# Altium schematic sheet DP.SchDoc
size A3; SPICEModelCacheHOTVAOKI: <root> / <DocumentId>HOTVAOKI</DocumentId> / </root>; SheetNumber: 4; SheetTotal: 9
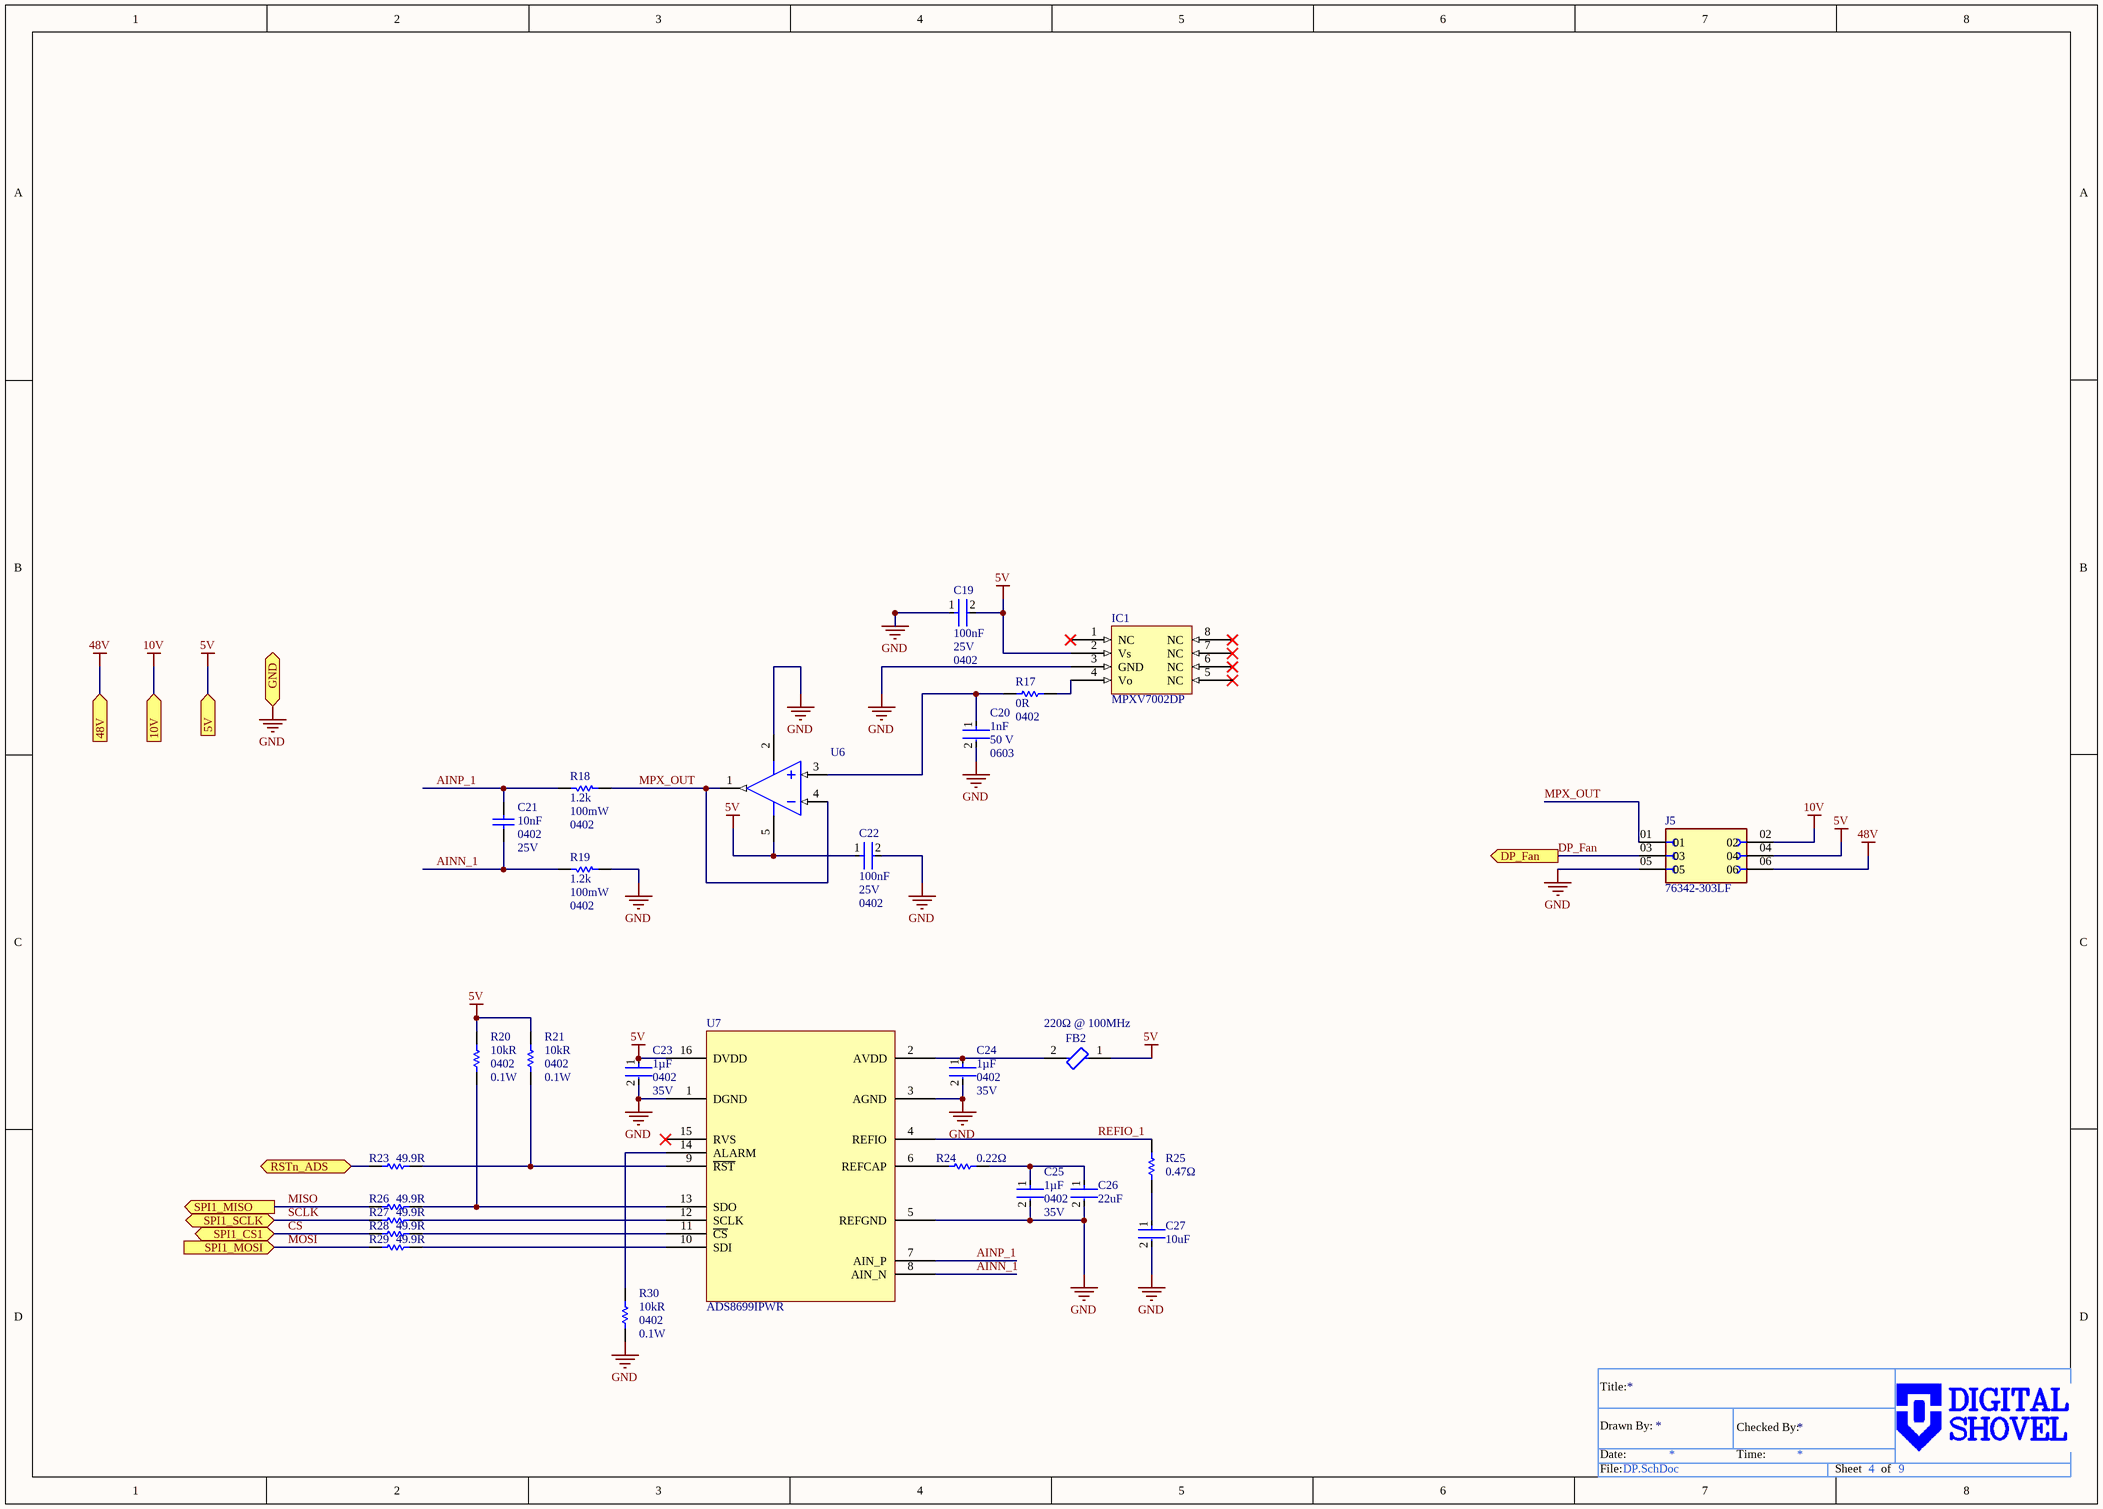
[diagram p0: DP.SchDoc]

## Parts
C19  value 100nF  Voltage Rating: 25V  Case/Package: 0402  [FP-CL830-IPC_A]  (hidden comment: CL05B104KA5NNNC)
C20  value 1nF  Voltage Rating: 50 V  Package: 0603  [FP-C0603C-CF-MFG]  (hidden comment: C0603C102K5RACTU)
C21  value 10nF  Package: 0402  Parameter 1: 25V  [CAPC1005X55X25ML05T10]  (hidden comment: GRM155R71E103KA01D)
C22  value 100nF  Voltage Rating: 25V  Case/Package: 0402  [FP-CL830-IPC_A]  (hidden comment: CL05B104KA5NNNC)
C23  value 1µF  Case/Package: 0402  Voltage Rating: 35V  [FP-C1005-050-0_05-IPC_A]  (hidden comment: C1005JB1V105K050BC)
C24  value 1µF  Case/Package: 0402  Voltage Rating: 35V  [FP-C1005-050-0_05-IPC_A]  (hidden comment: C1005JB1V105K050BC)
C25  value 1µF  Case/Package: 0402  Voltage Rating: 35V  [FP-C1005-050-0_05-IPC_A]  (hidden comment: C1005JB1V105K050BC)
C26  value 22uF  [FP-GRM21B-0_2-e0_2_0_7-IPC_A]  (hidden comment: GRM21BR61C226ME44L)
C27  value 10uF  [FP-CL21-IPC_B]  (hidden comment: CL21A106KAFN3NE)
FB2  value 220Ω @ 100MHz  [FP-BLM18-0_15-t0_8-IPC_C]  (hidden comment: BLM18KG221SN1D)
IC1  MPXV7002DP  [MPXV7002DP-Footprint-1]
J5  76342-303LF  [AMPHENOL_76342-303LF]
R17  value 0R  Package: 0402  [FP-RK73Z1E-IPC_B]  (hidden comment: RK73Z1ETTP)
R18  value 1.2k  Power: 100mW  Case/Package: 0402  [RESC1005X40X25LL10T10]  (hidden comment: RK73H1ETTP1201F)
R19  value 1.2k  Power: 100mW  Case/Package: 0402  [RESC1005X40X25LL10T10]  (hidden comment: RK73H1ETTP1201F)
R20  value 10kR  Package: 0402  Power Rating: 0.1W  [RESC1005X40X25LL10T10]  (hidden comment: RK73H1ETTP1002F)
R21  value 10kR  Package: 0402  Power Rating: 0.1W  [RESC1005X40X25LL10T10]  (hidden comment: RK73H1ETTP1002F)
R23  value 49.9R  [RESC1005X40X25LL10T10]  (hidden comment: RK73H1ETTP49R9F)
R24  value 0.22Ω  [RESC1608X55X30NL15T15]  (hidden comment: ERJ-3RQFR22V)
R25  value 0.47Ω  [RESC1608X55X30ML15T15]  (hidden comment: ERJ-3RQFR47V)
R26  value 49.9R  [RESC1005X40X25LL10T10]  (hidden comment: RK73H1ETTP49R9F)
R27  value 49.9R  [RESC1005X40X25LL10T10]  (hidden comment: RK73H1ETTP49R9F)
R28  value 49.9R  [RESC1005X40X25LL10T10]  (hidden comment: RK73H1ETTP49R9F)
R29  value 49.9R  [RESC1005X40X25LL10T10]  (hidden comment: RK73H1ETTP49R9F)
R30  value 10kR  Package: 0402  Power Rating: 0.1W  [RESC1005X40X25LL10T10]  (hidden comment: RK73H1ETTP1002F)
U6  THS4281DBVR  [DBV0005A_L]  (value not drawn)
U7  ADS8699IPWR  [TSOP65P640X120-16N]

## Ports
5V (in), 10V (in), 48V (in), DP_Fan (out), GND (bidir), RSTn_ADS (bidir), SPI1_CS1 (bidir), SPI1_MISO (out), SPI1_MOSI (in), SPI1_SCLK (bidir)

## Nets
5V: C19.2 C22.1 C23.1 FB2.1 IC1.2(Vs) J5.04 R20.2 R21.2 U6.5(VS+) U7.16(DVDD) ; port 5V
10V: J5.02 ; port 10V
48V: J5.06 ; port 48V
GND: C19.1 C20.2 C22.2 C23.2 C24.2 C25.2 C26.2 C27.2 IC1.3(GND) J5.05 R19.1 R30.1 U6.2(VS-) U7.1(DGND) U7.3(AGND) U7.5(REFGND) ; port GND
~{C}S: R28.1 ; port SPI1_CS1
AINN_1: C21.1 R19.2 U7.8(AIN_N)
AINP_1: C21.2 R18.2 U7.7(AIN_P)
DP_Fan: J5.03 ; port DP_Fan
MISO: R26.1 ; port SPI1_MISO
MOSI: R29.1 ; port SPI1_MOSI
MPX_OUT: J5.01 R18.1 U6.1(VOUT) U6.4(IN-)
REFIO_1: R25.2 U7.4(REFIO)
RSTn_ADS: R23.1 ; port RSTn_ADS
SCLK: R27.1 ; port SPI1_SCLK
NetC20_1: C20.1 R17.2 U6.3(IN+)
NetC24_1: C24.1 FB2.2 U7.2(AVDD)
NetC25_1: C25.1 C26.1 R24.2
NetC27_1: C27.1 R25.1
NetIC1_4: IC1.4(Vo) R17.1
NetR20_1: R20.1 R26.2 U7.13(SDO)
NetR21_1: R21.1 R23.2 U7.9(~{RST})
NetR24_1: R24.1 U7.6(REFCAP)
NetR27_2: R27.2 U7.12(SCLK)
NetR28_2: R28.2 U7.11(~{CS})
NetR29_2: R29.2 U7.10(SDI)
NetR30_2: R30.2 U7.14(ALARM)

Not connected (* = marked no-connect by the designer): IC1 1(NC)* 5(NC)* 6(NC)* 7(NC)* 8(NC)*; U7 15(RVS)*

## Notes on the sheet
- Title:
- Date:
- Drawn By:
- Time:
- Checked By:
- File:
- Sheet
- of

## Library data of the parts
C19 C22 = CMP-001-00333-1: Ceramic Capacitor, Multilayer, Ceramic, 25V, 10% +Tol, 10% -Tol, X7R, 15% TC, 0.1uF, Surface Mount, 0402; Max Operating Temperature: 125°C; RoHS Compliant: Yes; Capacitor Type: Ceramic; Min Operating Temperature: -55°C; Pins: 2; Mounting Technology: Surface Mount
C20 = CMP-2006-03022-3: CAP CER 1000PF 50V X7R 0603; Manufacturer: KEMET; Automotive Grade: Grade 1; Tolerance: 0.1; Capacitance: 1,000 pF; Temperature Coefficient: 30ppm/°C; Material: Ceramic; Temperature Characteristic: X7R; ComponentLink2URL: https://api.kemet.com/component-edge/download/datasheet/C0603C100J5GACAUTO.pdf; Temperature Range Low: -55°C; Device Class L2: Capacitors; Device Class L3: Ceramic Capacitors; Device Class L1: Passive Components; Temperature Range High: +125°C; Manufacturer Part Number: C0603C102K5RACTU; Digikey Description: CAP CER 1000PF 50V X7R 0603; Temperature: -55°C to +125°C; Mouser Description: Capacitor; Ceramic; Cap; 1000pF; Tol 10%; SMT; Vol-Rtg 50V; X7R; Tape and Reel; Automotive: Yes; RoHS: TRUE; Octopart: https://octopart.com/c0603c102k5ractu-kemet-144878; Height: 0.87mm; Lead Free: Yes; Category: Cap; ComponentLink2Description: Datasheet
C21 = CMP-x00072-1: Ceramic Capacitor, Multilayer, Ceramic, 25V, 10% +Tol, 10% -Tol, X7R, 15% TC, 0.01uF, Surface Mount, 0402; Manufacturer: Murata; Template: MR_0402; Vendor: TTI; Reel Width: 8mm; Mounting: SMT; MOQ: 10000; Category: Capacitor; Price: 0.00352
C23-C25 = CMP-001-00329-1: Ceramic Capacitor, Multilayer, Ceramic, 35V, 10% +Tol, 10% -Tol, JB, 10% TC, 1uF, Surface Mount, 0402; Capacitor Type: Ceramic; Min Operating Temperature: -25°C; RoHS Compliant: Yes; Max Operating Temperature: 85°C; Pins: 2; Mounting Technology: Surface Mount
C26 = CMP-06035-026322-1: Chip Multilayer Ceramic Capacitors for General Purpose, 0805, 22uF, X5R, 15%, 20%, 16V; Height: 1.25mm; Thickness: 0.057inch; Min Operating Temperature: -55°C; Tolerance: 20%; Package Quantity: 3000; Packaging: Tape and Reel; Case/Package: 0805; Voltage Rating: 16V; Dielectric: X5R; Max Operating Temperature: 85°C; Case Code (Metric): 2012; Depth: 1.25mm; Lead Free: Lead Free; Termination: SMD/SMT; Case Code (Imperial): 0805; Voltage Rating (DC): 16V; Length: 2mm; Weight: 0.000335oz; Width: 0.049inch; Mount: Surface Mount
C27 = CMP-13271-000854-1: CL21 Series 0805 10uF 25V ±10% Tolerance X5R Multilayer Ceramic Chip Capacitor; Tolerance: 10%; Package Quantity: 1; Case/Package: 0805; Length: 0.079inch; Mount: Surface Mount; Thickness: 0.053inch; Width: 0.049inch; Voltage Rating: 25V; Min Operating Temperature: -55°C; Packaging: Cut Tape; Lead Free: Lead Free; Max Operating Temperature: 85°C; Case Code (Metric): 2012; Case Code (Imperial): 0805
FB2 = CMP-006-00035-1: Ferrite Chip, 1 Function(s), 2.2A, 2 Pin(s); Vendor: TTI; Reel Size: 8mm; MOQ: 4000; Package: 0603; Mounting: SMT; Rating: 2.2A; Category: Ferrite Bead; Price: 0.0219
IC1 = CMP-010-00029-6: Manufacturer: NXP; Reel Width: Tray; Vendor: Mouser; Template: NXP_SOP_8; Mounting: SMT; Package: SOP-8; Category: IC; Price: 23.85; MOQ: 1
J5 = CMP-035-000000-1: Dubox, Board To Board Connector, Receptacle, Vertical, Through Hole, Top Entry, Double Row , 6 Positions, 2.54mm (0.100in) Pitch; MF: Amphenol; Component Type: Standard; Design Item ID: 76342-303LF; Pin Count: 6; MP: 76342-303LF; Source: 76342-303LF.SchLib; SnapEDA_Link: https://www.snapeda.com/parts/76342-303LF/Amphenol/view-part/?ref=snap; Value: *; Check_prices: https://www.snapeda.com/parts/76342-303LF/Amphenol/view-part/?ref=eda; Package: None
R17 = CMP-x00147-2: Metal Glaze/thick Film, 0ohm, Surface Mount, 0402; Template: KS_0402_R
R18 R19 = CMP-009-01022-2: Fixed Resistor, Metal Glaze/thick Film, 0.1W, 1200ohm, 75V, 1% +/-Tol, 100ppm/Cel, Surface Mount, 0402; RoHS Compliant: Yes; Max Operating Temperature: 155°C; Min Operating Temperature: -55°C; Tolerance: 1%; Pins: 2; Mounting Technology: Surface Mount
R20 R21 R30 = CMP-x00150-2: Fixed Resistor, Metal Glaze/thick Film, 0.1W, 10000ohm, 75V, 1% +/-Tol, 100ppm/Cel, Surface Mount, 0402; Template: KS_0402_R
R23 R26-R29 = CMP-x00154-2: Fixed Resistor, Metal Glaze/thick Film, 0.1W, 49.9ohm, 75V, 1% +/-Tol, 100ppm/Cel, Surface Mount, 0402; Template: KS_0402_R; Package: 0402
R24 = CMP-2000-00853-1: Manufacturer: Panasonic; Part Number: ERJ-3RQFR22V
R25 = CMP-2000-00857-1: Manufacturer: Panasonic; Part Number: ERJ-3RQFR47V
U6 = CMP-0018-00449-2: Very Low-Power High Speed Rail-to-Rail Input / Output Voltage Feedback Operational Amplifier, 2.7 to 16.5 V, -40 to 85 degC, 5-pin SOT23 (DBV5), Green (RoHS & no Sb/Br); Manufacturer: Texas Instruments; Settling Time (0.1%)(Typ)(ns): 78; Io(Typ)(mA): 30; Vs(Min)(V): 2.7; Acl, min stable gain(V/V): 1; THD (Fc is 1 MHz)(Typ)(dB): -67; Rail-Rail: In, Out; Sub Family: High Speed Amplifier (>=50MHz), Low Supply Voltage Amplifier (<=2.7V); Diff Phase(deg): 0.11; Slew Rate(Typ)(V/us): 35; Vn at Flatband(Typ)(nV/rtHz): 12.5; Vs(Max)(V): 16.5; 3rd Harmonic(dBc): 52; Vio(Max)(mV): 3.5; BW @ Acl(MHz): 90; Iib(Max)(nA): 1000; ComponentLink2URL: http://www.ti.com/general/docs/lit/getliterature.tsp?genericPartNumber=THS4281&fileType=pdf; ComponentLink1URL: http://www.ti.com/; PackageReference: DBV0005A; DatasheetVersion: SLOS432A; PartNumber: THS4281DBVR; ComponentLink1Description: Manufacturer URL; Mounting Technology: Surface Mount; Number of Channels: 1; Iq per channel(Max)(mA): 1; Diff Gain(%): 0.11; Code_JEDEC: MO-178; ComponentLink2Description: Datasheet; ComponentLink3URL: http://www.ti.com/litv/pdf/mpds018i; 2nd Harmonic(dBc): 52; ComponentLink3Description: Package Specification; PackageVersion: 4073253-4/K, 03/2006; Eco-Plan: Green (RoHS & no Sb/Br); PackageDescription: 5-Pin Plastic Small Outline, Body 1.6 x 2.9 mm, Pitch 0.95 mm; @ MHz: 1
U7 = CMP-001-0096-1: ADC, Successive Approximation, 18-Bit, 1 Func, 1 Channel, Serial Access, PDSO16